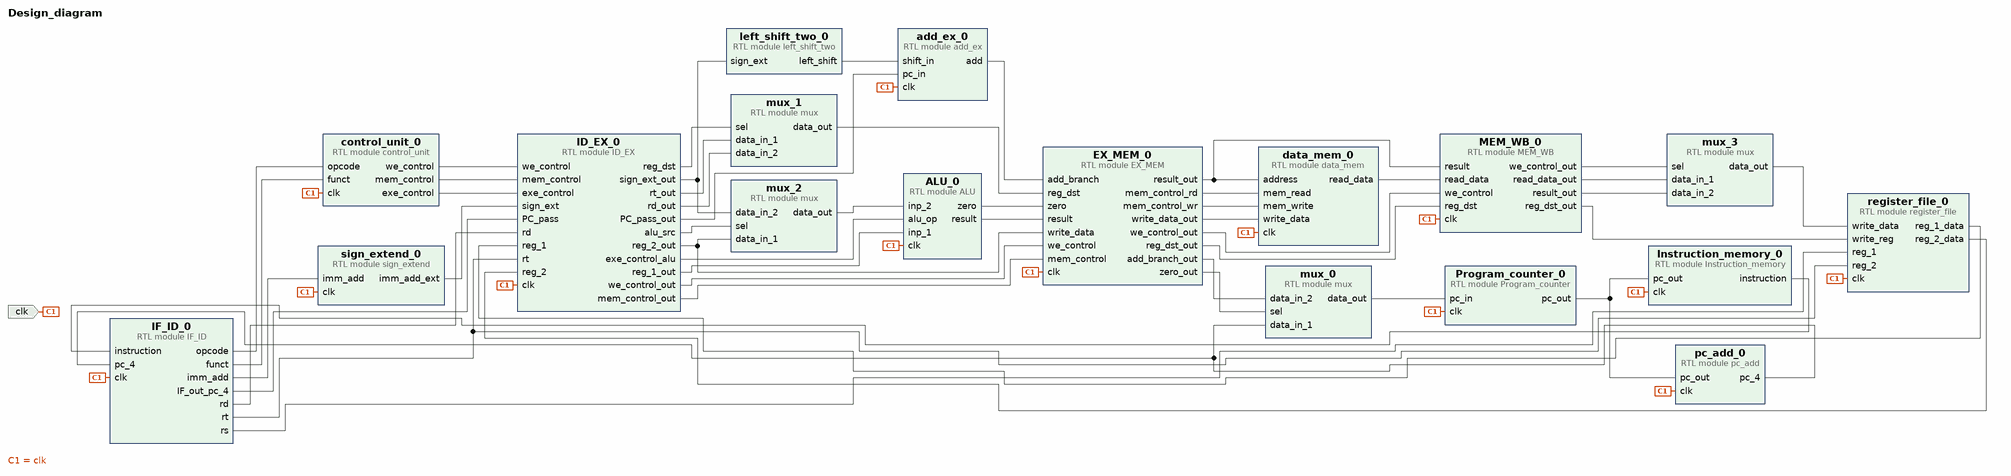
[diagram p0: block diagram of the top level]
# Vivado block design Design_diagram, xc7a200tiffv1156-1L, Vivado 2020.2
create_bd_design Design_diagram

create_bd_port -dir I -type clk clk
set_property -dict {CONFIG.FREQ_HZ 100000000} [get_bd_ports clk]

create_bd_cell -type module -reference mux mux_0
create_bd_cell -type module -reference Program_counter Program_counter_0
create_bd_cell -type module -reference pc_add pc_add_0
create_bd_cell -type module -reference IF_ID IF_ID_0
create_bd_cell -type module -reference add_ex add_ex_0
create_bd_cell -type module -reference mux mux_1
set_property -dict {CONFIG.inp 5} [get_bd_cells mux_1]
create_bd_cell -type module -reference mux mux_2
create_bd_cell -type module -reference data_mem data_mem_0
create_bd_cell -type module -reference mux mux_3
create_bd_cell -type module -reference EX_MEM EX_MEM_0
create_bd_cell -type module -reference left_shift_two left_shift_two_0
create_bd_cell -type module -reference ALU ALU_0
create_bd_cell -type module -reference sign_extend sign_extend_0
create_bd_cell -type module -reference MEM_WB MEM_WB_0
create_bd_cell -type module -reference control_unit control_unit_0
create_bd_cell -type module -reference Instruction_memory Instruction_memory_0
create_bd_cell -type module -reference register_file register_file_0
create_bd_cell -type module -reference ID_EX ID_EX_0

# ---- connections ----

connect_bd_net [get_bd_pins Instruction_memory_0/instruction] [get_bd_pins IF_ID_0/instruction]
connect_bd_net [get_bd_pins pc_add_0/pc_4] [get_bd_pins mux_0/data_in_1] [get_bd_pins IF_ID_0/pc_4]
connect_bd_net [get_bd_ports clk] \
  [get_bd_pins Program_counter_0/clk] [get_bd_pins pc_add_0/clk] [get_bd_pins IF_ID_0/clk] [get_bd_pins add_ex_0/clk] \
  [get_bd_pins data_mem_0/clk] [get_bd_pins EX_MEM_0/clk] [get_bd_pins ALU_0/clk] [get_bd_pins sign_extend_0/clk] \
  [get_bd_pins MEM_WB_0/clk] [get_bd_pins control_unit_0/clk] [get_bd_pins Instruction_memory_0/clk] \
  [get_bd_pins register_file_0/clk] [get_bd_pins ID_EX_0/clk]
connect_bd_net [get_bd_pins Program_counter_0/pc_out] [get_bd_pins pc_add_0/pc_out] [get_bd_pins Instruction_memory_0/pc_out]
connect_bd_net [get_bd_pins mux_0/data_out] [get_bd_pins Program_counter_0/pc_in]
connect_bd_net [get_bd_pins IF_ID_0/IF_out_pc_4] [get_bd_pins ID_EX_0/PC_pass]
connect_bd_net [get_bd_pins control_unit_0/we_control] [get_bd_pins ID_EX_0/we_control]
connect_bd_net [get_bd_pins control_unit_0/mem_control] [get_bd_pins ID_EX_0/mem_control]
connect_bd_net [get_bd_pins control_unit_0/exe_control] [get_bd_pins ID_EX_0/exe_control]
connect_bd_net [get_bd_pins IF_ID_0/opcode] [get_bd_pins control_unit_0/opcode]
connect_bd_net [get_bd_pins IF_ID_0/funct] [get_bd_pins control_unit_0/funct]
connect_bd_net [get_bd_pins IF_ID_0/rs] [get_bd_pins register_file_0/reg_1]
connect_bd_net [get_bd_pins IF_ID_0/rt] [get_bd_pins register_file_0/reg_2] [get_bd_pins ID_EX_0/rt]
connect_bd_net [get_bd_pins IF_ID_0/rd] [get_bd_pins ID_EX_0/rd]
connect_bd_net [get_bd_pins IF_ID_0/imm_add] [get_bd_pins sign_extend_0/imm_add]
connect_bd_net [get_bd_pins sign_extend_0/imm_add_ext] [get_bd_pins ID_EX_0/sign_ext]
connect_bd_net [get_bd_pins register_file_0/reg_1_data] [get_bd_pins ID_EX_0/reg_1]
connect_bd_net [get_bd_pins register_file_0/reg_2_data] [get_bd_pins ID_EX_0/reg_2]
connect_bd_net [get_bd_pins ID_EX_0/sign_ext_out] [get_bd_pins mux_2/data_in_2] [get_bd_pins left_shift_two_0/sign_ext]
connect_bd_net [get_bd_pins ID_EX_0/PC_pass_out] [get_bd_pins add_ex_0/pc_in]
connect_bd_net [get_bd_pins left_shift_two_0/left_shift] [get_bd_pins add_ex_0/shift_in]
connect_bd_net [get_bd_pins add_ex_0/add] [get_bd_pins EX_MEM_0/add_branch]
connect_bd_net [get_bd_pins ID_EX_0/exe_control_alu] [get_bd_pins ALU_0/alu_op]
connect_bd_net [get_bd_pins ID_EX_0/alu_src] [get_bd_pins mux_2/sel]
connect_bd_net [get_bd_pins ID_EX_0/reg_dst] [get_bd_pins mux_1/sel]
connect_bd_net [get_bd_pins ID_EX_0/reg_2_out] [get_bd_pins mux_2/data_in_1] [get_bd_pins EX_MEM_0/write_data]
connect_bd_net [get_bd_pins mux_2/data_out] [get_bd_pins ALU_0/inp_2]
connect_bd_net [get_bd_pins ID_EX_0/rt_out] [get_bd_pins mux_1/data_in_1]
connect_bd_net [get_bd_pins ID_EX_0/rd_out] [get_bd_pins mux_1/data_in_2]
connect_bd_net [get_bd_pins mux_1/data_out] [get_bd_pins EX_MEM_0/reg_dst]
connect_bd_net [get_bd_pins ALU_0/zero] [get_bd_pins EX_MEM_0/zero]
connect_bd_net [get_bd_pins ALU_0/result] [get_bd_pins EX_MEM_0/result]
connect_bd_net [get_bd_pins ID_EX_0/we_control_out] [get_bd_pins EX_MEM_0/we_control]
connect_bd_net [get_bd_pins ID_EX_0/mem_control_out] [get_bd_pins EX_MEM_0/mem_control]
connect_bd_net [get_bd_pins EX_MEM_0/add_branch_out] [get_bd_pins mux_0/data_in_2]
connect_bd_net [get_bd_pins EX_MEM_0/zero_out] [get_bd_pins mux_0/sel]
connect_bd_net [get_bd_pins MEM_WB_0/we_control_out] [get_bd_pins mux_3/sel]
connect_bd_net [get_bd_pins MEM_WB_0/read_data_out] [get_bd_pins mux_3/data_in_1]
connect_bd_net [get_bd_pins MEM_WB_0/result_out] [get_bd_pins mux_3/data_in_2]
connect_bd_net [get_bd_pins data_mem_0/read_data] [get_bd_pins MEM_WB_0/read_data]
connect_bd_net [get_bd_pins EX_MEM_0/mem_control_rd] [get_bd_pins data_mem_0/mem_read]
connect_bd_net [get_bd_pins EX_MEM_0/mem_control_wr] [get_bd_pins data_mem_0/mem_write]
connect_bd_net [get_bd_pins EX_MEM_0/we_control_out] [get_bd_pins MEM_WB_0/we_control]
connect_bd_net [get_bd_pins EX_MEM_0/result_out] [get_bd_pins data_mem_0/address] [get_bd_pins MEM_WB_0/result]
connect_bd_net [get_bd_pins EX_MEM_0/reg_dst_out] [get_bd_pins MEM_WB_0/reg_dst]
connect_bd_net [get_bd_pins EX_MEM_0/write_data_out] [get_bd_pins data_mem_0/write_data]
connect_bd_net [get_bd_pins mux_3/data_out] [get_bd_pins register_file_0/write_data]
connect_bd_net [get_bd_pins MEM_WB_0/reg_dst_out] [get_bd_pins register_file_0/write_reg]
connect_bd_net [get_bd_pins ID_EX_0/reg_1_out] [get_bd_pins ALU_0/inp_1]

validate_bd_design
save_bd_design
